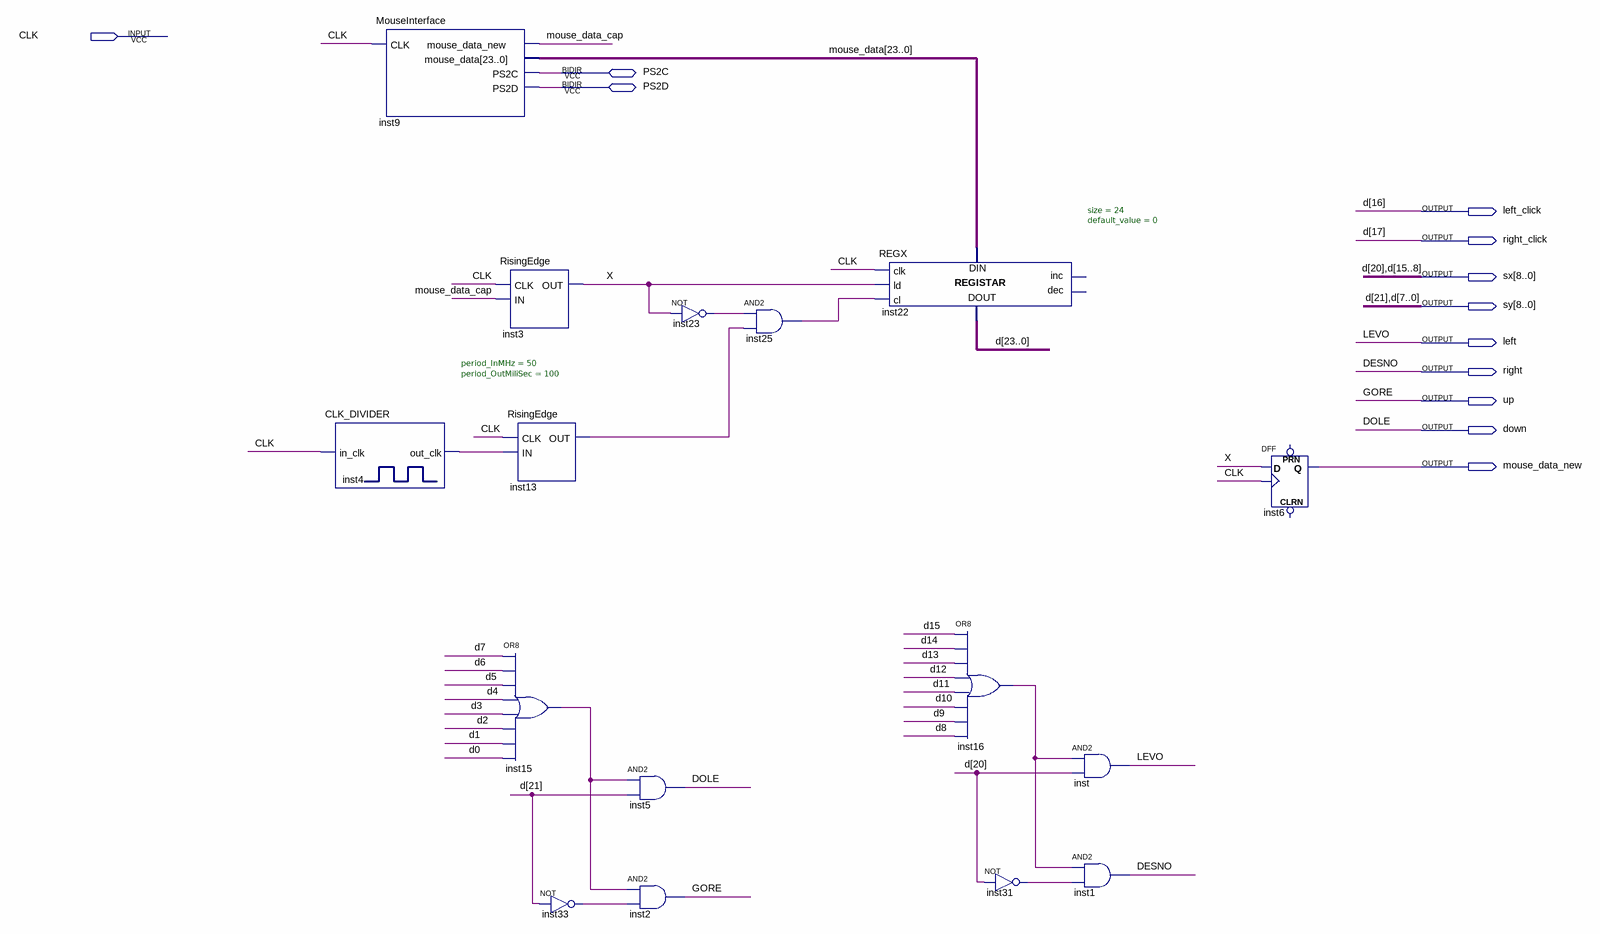
[diagram p0: schematic sheet]
// Quartus schematic MouseController.bdf as structural Verilog: 16 symbols, 12 pins
module MouseController (
  input  CLK,
  inout  PS2C,
  inout  PS2D,
  output left_click,
  output right_click,
  output [8:0] sx,
  output [8:0] sy,
  output left,
  output right,
  output up,
  output down,
  output mouse_data_new
);

  wire inst4_out_clk, inst13_out, inst15_out, inst16_out, inst23_out, inst25_out, inst31_out, inst33_out,
       mouse_data_cap, X;
  wire [23:0] mouse_data;
  wire [23:18] d;

  CLK_DIVIDER #(.period_InMHz(50), .period_OutMiliSec(100)) inst4 (.in_clk(CLK), .out_clk(inst4_out_clk));
  MouseInterface inst9 (.CLK(CLK), .mouse_data_new(mouse_data_cap), .mouse_data(mouse_data), .PS2C(PS2C), .PS2D(PS2D));
  RisingEdge inst3 (.CLK(CLK), .IN(mouse_data_cap), .OUT(X));
  RisingEdge inst13 (.CLK(CLK), .IN(inst4_out_clk), .OUT(inst13_out));
  or inst15 (inst15_out, sy[7], sy[6], sy[5], sy[4], sy[3], sy[2], sy[1], sy[0]);
  not inst33 (inst33_out, sy[8]);
  not inst23 (inst23_out, X);
  and inst5 (down, inst15_out, sy[8]);
  and inst2 (up, inst15_out, inst33_out);
  and inst25 (inst25_out, inst23_out, inst13_out);
  REGX #(.size(24), .default_value(0)) inst22 (
    .clk(CLK), .ld(X), .cl(inst25_out), .data_in(mouse_data),
    .data_out({d[23:22], sy[8], sx[8], d[19:18], right_click, left_click, sx[7:0], sy[7:0]}));  // open: inc, dec
  or inst16 (inst16_out, sx[7], sx[6], sx[5], sx[4], sx[3], sx[2], sx[1], sx[0]);
  not inst31 (inst31_out, sx[8]);
  and inst (left, inst16_out, sx[8]);
  and inst1 (right, inst16_out, inst31_out);
  DFF inst6 (.CLK(CLK), .D(X), .Q(mouse_data_new));  // open: CLRN, PRN

  // Other names for the same wires on the sheet: d (some bits) = {sy[8], sx[8], right_click, left_click, sx[7:0], sy[7:0]};
  //   d0 = sy[0]; d1 = sy[1]; d2 = sy[2]; d3 = sy[3]; d4 = sy[4]; d5 = sy[5]; d6 = sy[6]; d7 = sy[7]; d8 = sx[0];
  //   d9 = sx[1]; d10 = sx[2]; d11 = sx[3]; d12 = sx[4]; d13 = sx[5]; d14 = sx[6]; d15 = sx[7]; DESNO = right;
  //   DOLE = down; GORE = up; LEVO = left
endmodule
